# EAGLE design Power PCB (EAGLE 9.6.2)
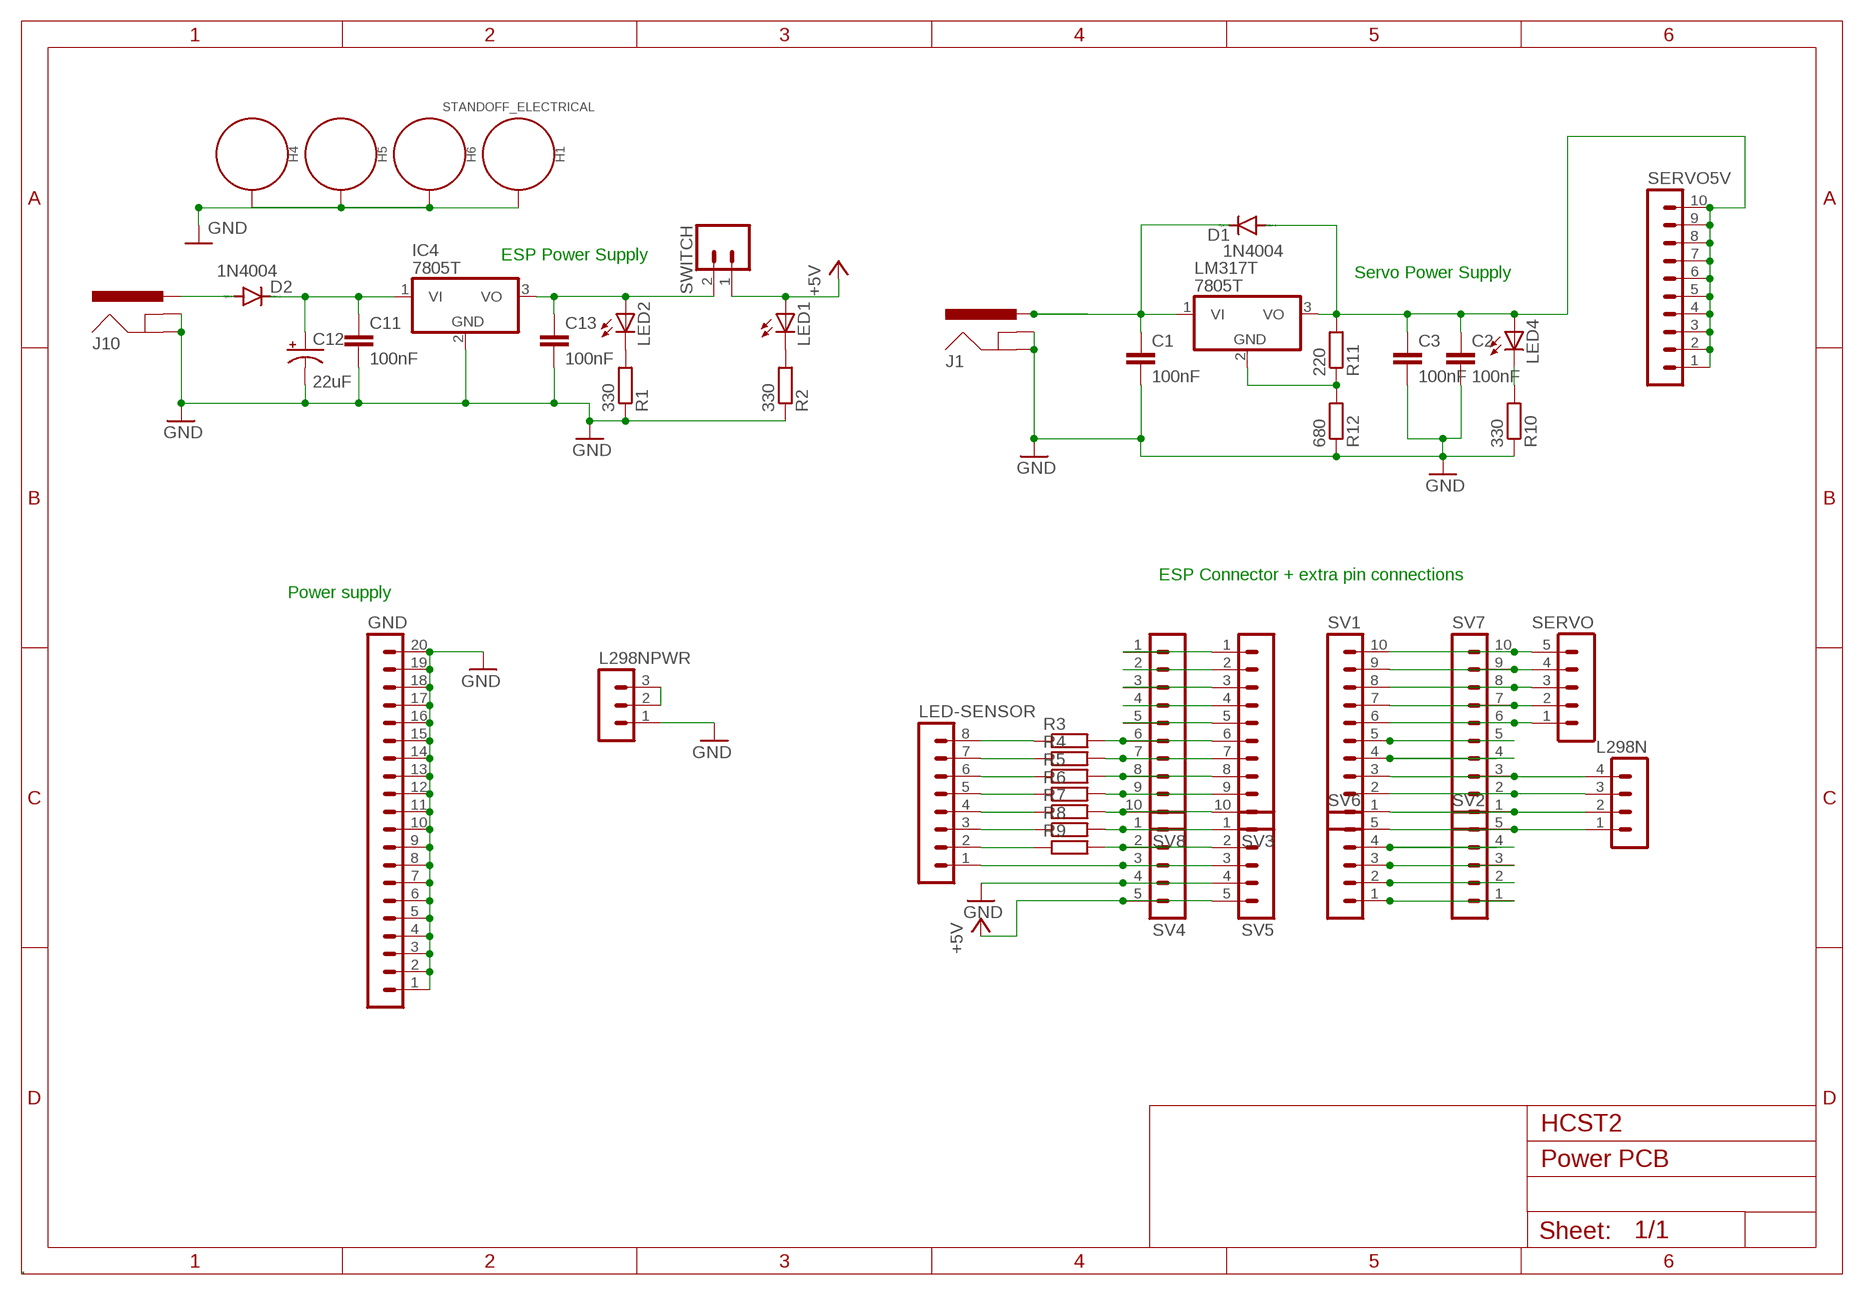
[diagram p0: schematic, sheet 1]

## Parts
C1  100nF  C2.5/2  [C2.5-2]
C2  100nF  C2.5/2  [C2.5-2]
C3  100nF  C2.5/2  [C2.5-2]
C11  100nF  C2.5/2  [C2.5-2]
C12  22uF  CPOL-USE2.5-7  [E2,5-7]
C13  100nF  C2.5/2  [C2.5-2]
D1  1N4004  [DO41-10]
D2  1N4004  [DO41-10]
GND  MA20-1  [MA20-1]
H1  STANDOFF_ELECTRICAL  [STANDOFF-ELECTRICAL]
H4  STANDOFF_ELECTRICAL  [STANDOFF-ELECTRICAL]
H5  STANDOFF_ELECTRICAL  [STANDOFF-ELECTRICAL]
H6  STANDOFF_ELECTRICAL  [STANDOFF-ELECTRICAL]
IC4  7805T  [TO220H]
J1  EL311-ROBOT_SPARKFUN-CONNECTORS_POWER_JACKPTH  [EL311-ROBOT_SPARKFUN-CONNECTORS_POWER_JACK_PTH]
J10  EL311-ROBOT_SPARKFUN-CONNECTORS_POWER_JACKPTH  [EL311-ROBOT_SPARKFUN-CONNECTORS_POWER_JACK_PTH]
L298N  MA04-1  [MA04-1]
L298NPWR  MA03-1  [MA03-1]
LED1  LED3MM  [LED3MM]
LED2  LED3MM  [LED3MM]
LED4  LED3MM  [LED3MM]
LED-SENSOR  MA08-1  [MA08-1]
LM317T  7805T  [TO220H]
R1  330  R-EU_0207/10  [0207/10]
R2  330  R-EU_0207/10  [0207/10]
R3  R-EU_0207/10  [0207/10]
R4  R-EU_0207/10  [0207/10]
R5  R-EU_0207/10  [0207/10]
R6  R-EU_0207/10  [0207/10]
R7  R-EU_0207/10  [0207/10]
R8  R-EU_0207/10  [0207/10]
R9  R-EU_0207/10  [0207/10]
R10  330  R-EU_0207/10  [0207/10]
R11  220  R-EU_0207/10  [0207/10]
R12  680  R-EU_0207/10  [0207/10]
SERVO  MA05-1  [MA05-1]
SERVO5V  MA10-1  [MA10-1]
SV1  MA10-1  [MA10-1]
SV2  MA05-1  [MA05-1]
SV3  MA10-1  [MA10-1]
SV4  MA05-1  [MA05-1]
SV5  MA05-1  [MA05-1]
SV6  MA05-1  [MA05-1]
SV7  MA10-1  [MA10-1]
SV8  MA10-1  [MA10-1]
SWITCH  CONN_02  [1X02]

## Nets
+5V [power]: LED1.A SV4.5 SV5.5 SWITCH.1
GND [power]: C1.2 C2.2 C3.2 C11.2 C12.- C13.2 GND.1 GND.2 GND.3 GND.4 GND.5 GND.6 GND.7 GND.8 GND.9 GND.10 GND.11 GND.12 GND.13 GND.14 GND.15 GND.16 GND.17 GND.18 GND.19 GND.20 H1.P1 H4.P1 H5.P1 H6.P1 IC4.2(GND) J1.GND J1.GNDBREAK J10.GND J10.GNDBREAK L298NPWR.1 R1.1 R2.1 R10.1 R12.1 SV4.4 SV5.4
N$1: L298N.1 SV2.5 SV6.5
N$2: SV1.5 SV7.5
N$3: SV1.4 SV7.4
N$4: SV2.4 SV6.4
N$5: SV2.3 SV6.3
N$6: LM317T.2(GND) R11.1 R12.2
N$7: L298N.2 SV1.1 SV7.1
N$8: L298N.3 SV1.2 SV7.2
N$9: L298N.4 SV1.3 SV7.3
N$10: SERVO.4 SV1.9 SV7.9
N$11: SERVO.3 SV1.8 SV7.8
N$12: SERVO.2 SV1.7 SV7.7
N$13: SERVO.1 SV1.6 SV7.6
N$14: SV2.2 SV6.2
N$15 [power]: C2.1 C3.1 D1.A LED4.A LM317T.3(VO) R11.2 SERVO5V.1 SERVO5V.2 SERVO5V.3 SERVO5V.4 SERVO5V.5 SERVO5V.6 SERVO5V.7 SERVO5V.8 SERVO5V.9 SERVO5V.10
N$16: LED-SENSOR.2 R9.1
N$17: LED4.K(C) R10.2
N$18: SV2.1 SV6.1
N$19: SV3.1 SV8.1
N$20: SV3.2 SV8.2
N$21: SV3.3 SV8.3
N$22: LED-SENSOR.1 SV4.3 SV5.3
N$23: R9.2 SV4.2 SV5.2
N$24: R8.2 SV4.1 SV5.1
N$25: R7.2 SV3.10 SV8.10
N$26: R6.2 SV3.9 SV8.9
N$27: R5.2 SV3.8 SV8.8
N$28: R4.2 SV3.7 SV8.7
N$29: SV3.4 SV8.4
N$30: SV3.5 SV8.5
N$34: R3.2 SV3.6 SV8.6
N$35 [power]: C13.1 IC4.3(VO) LED2.A SWITCH.2
N$36 [power]: L298NPWR.2 L298NPWR.3
N$38: LED2.K(C) R1.2
N$39: LED1.K(C) R2.2
N$41: LED-SENSOR.8 R3.1
N$42: LED-SENSOR.7 R4.1
N$43: LED-SENSOR.6 R5.1
N$44: LED-SENSOR.5 R6.1
N$45: LED-SENSOR.4 R7.1
N$46: LED-SENSOR.3 R8.1
N$47 [power]: SERVO.5 SV1.10 SV7.10
PWR1 [power]: C1.1 D1.C J1.PWR LM317T.1(VI)
PWR3 [power]: D2.A J10.PWR
PWR4 [power]: C11.1 C12.+ D2.C IC4.1(VI)

## Notes on the sheet
- ESP Power Supply
- Servo Power Supply
- ESP Connector + extra pin connections
- Power supply
- HCST2
- .

## Library data of the parts
C1-C3 C11 C13 = capacitor-wima:C: CAPACITOR naming: grid - package width
C12 = adafruit:CPOL-US: POLARIZED CAPACITOR, American symbol
D1 D2 = diode:1N4004: DIODE general purpose rectifier, 1 A
GND = con-lstb:MA20-1: PIN HEADER; OC_FARNELL: unknown; OC_NEWARK: unknown
H1 = EL311 2021:STANDOFF_ELECTRICAL: Stand Off Drill holes with an electrical connection. For example, use these to ground your board to a chassis. Example SparkFun Products Screw - Phillips Head (1/4", 4-40, 10 pack) <https://www.sparkfun.com/products/10453> (PRT-10453) Screw - Phillips Head (1/2", 4-40, 10 pack) <https://www.sparkfun.com/products/10452> (PRT-10452) Screw - Phillips Head (3/4", 4-40, 10 pack) <https://www.sparkfun.com/products/10451> (PRT-10451) Screw - Phillips Head (1", 4-40, 10 pack) <https://www.sparkfun.com/products/10450> (PRT-10450)
H4-H6 = SparkFun-Hardware:STANDOFF_ELECTRICAL: Stand Off Drill holes with an electrical connection. For example, use these to ground your board to a chassis. Example SparkFun Products Screw - Phillips Head (1/4", 4-40, 10 pack) <https://www.sparkfun.com/products/10453> (PRT-10453) Screw - Phillips Head (1/2", 4-40, 10 pack) <https://www.sparkfun.com/products/10452> (PRT-10452) Screw - Phillips Head (3/4", 4-40, 10 pack) <https://www.sparkfun.com/products/10451> (PRT-10451) Screw - Phillips Head (1", 4-40, 10 pack) <https://www.sparkfun.com/products/10450> (PRT-10450)
IC4 LM317T = adafruit:78*: Positive VOLTAGE REGULATOR Added bigger pads to the TO-92 package
J1 J10 = EL311_2017_18:EL311-ROBOT_SPARKFUN-CONNECTORS_POWER_JACK: Power Jack This is the standard 5.5mm barrel jack for power. The PTH is the most common, proven, reliable, footprint. The Slot footprint only works if the mill layer is transmitted to the PCB fab house so be warned. Mating wall wart : TOL-00298 (and others); PROD_ID: PRT-00119
L298N = con-lstb:MA04-1: PIN HEADER; OC_FARNELL: unknown; OC_NEWARK: unknown
L298NPWR = con-lstb:MA03-1: PIN HEADER; OC_FARNELL: unknown; OC_NEWARK: unknown
LED1 LED2 LED4 = EL311 2021:LED: LED OSRAM: - CHIPLED LG R971, LG N971, LY N971, LG Q971, LY Q971, LO R971, LY R971 LH N974, LH R974 LS Q976, LO Q976, LY Q976 LO Q996 - Hyper CHIPLED LW Q18S LB Q993, LB Q99A, LB R99A - SideLED LS A670, LO A670, LY A670, LG A670, LP A670 LB A673, LV A673, LT A673, LW A673 LH A674 LY A675 LS A676, LA A676, LO A676, LY A676, LW A676 LS A679, LY A679, LG A679 - Hyper Micro SIDELED® LS Y876, LA Y876, LO Y876, LY Y876 LT Y87S - SmartLED LW L88C, LW L88S LB L89C, LB L89S, LG L890 LS L89K, LO L89K, LY L89K LS L896, LA L896, LO L896, LY L896 - TOPLED LS T670, LO T670, LY T670, LG T670, LP T670 LSG T670, LSP T670, LSY T670, LOP T670, LYG T670 LG T671, LOG T671, LSG T671 LB T673, LV T673, LT T673, LW T673 LH T674 LS T676, LA T676, LO T676, LY T676, LB T676, LH T676, LSB T676, LW T676 LB T67C, LV T67C, LT T67C, LS T67K, LO T67K, LY T67K, LW E67C LS E67B, LA E67B, LO E67B, LY E67B, LB E67C, LV E67C, LT E67C LW T67C LS T679, LY T679, LG T679 LS T770, LO T770, LY T770, LG T770, LP T770 LB T773, LV T773, LT T773, LW T773 LH T774 LS E675, LA E675, LY E675, LS T675 LS T776, LA T776, LO T776, LY T776, LB T776 LHGB T686 LT T68C, LB T68C - Hyper Mini TOPLED® LB M676 - Mini TOPLED Santana® LG M470 LS M47K, LO M47K, LY M47K Source: http://www.osram.convergy.de/
LED-SENSOR = con-lstb:MA08-1: PIN HEADER; OC_FARNELL: unknown; OC_NEWARK: unknown
R1-R12 = EL311 2021:R-EU_: RESISTOR, European symbol
SERVO SV2 SV4-SV6 = con-lstb:MA05-1: PIN HEADER; OC_FARNELL: unknown; OC_NEWARK: unknown
SERVO5V SV1 SV3 SV7 SV8 = con-lstb:MA10-1: PIN HEADER; OC_FARNELL: unknown; OC_NEWARK: unknown
SWITCH = EL311 2021:CONN_02: Multi connection point. Often used as Generic Header-pin footprint for 0.1 inch spaced/style header connections On any of the 0.1 inch spaced packages, you can populate with these: Break Away Headers - Straight <https://www.sparkfun.com/products/116> (PRT-00116) Break Away Male Headers - Right Angle <https://www.sparkfun.com/products/553> (PRT-00553) Female Headers <https://www.sparkfun.com/products/115> (PRT-00115) Break Away Headers - Machine Pin <https://www.sparkfun.com/products/117> (PRT-00117) Break Away Female Headers - Swiss Machine Pin <https://www.sparkfun.com/products/743> (PRT-00743) For SCREWTERMINALS and SPRING TERMINALS visit here: Screw Terimnals on SparkFun.com <https://www.sparkfun.com/search/results?term=Screw+Terminals> (5mm/3.5mm/2.54mm spacing) This device is also useful as a general connection point to wire up your design to another part of your project. Our various solder wires solder well into these plated through hole pads. Hook-Up Wire - Assortment (Stranded, 22 AWG) <https://www.sparkfun.com/products/11375> (PRT-11375) Hook-Up Wire - Assortment (Solid Core, 22 AWG) <https://www.sparkfun.com/products/11367> (PRT-11367) View the entire wire category on our website here <https://www.sparkfun.com/categories/141> Special notes: Molex polarized connector foot print use with: PRT-08233 with associated crimp pins and housings. 2.54_SCREWTERM for use with PRT-10571. 3.5mm Screw Terminal footprints for PRT-08084 5mm Screw Terminal footprints for use with PRT-08432; PROD_ID: CONN-13512; SF_ID: PRT-09918; SF_SKU: PRT-08432; SKU: PRT-09914

## Net classes
0 default: width 0.406 mm, drill 0.406 mm, clearance 0.406 mm
1 power: width 0.635 mm, drill 0.406 mm, clearance 0.406 mm
2 Power2: width 1.397 mm, drill 0.406 mm, clearance 0.406 mm

## Board
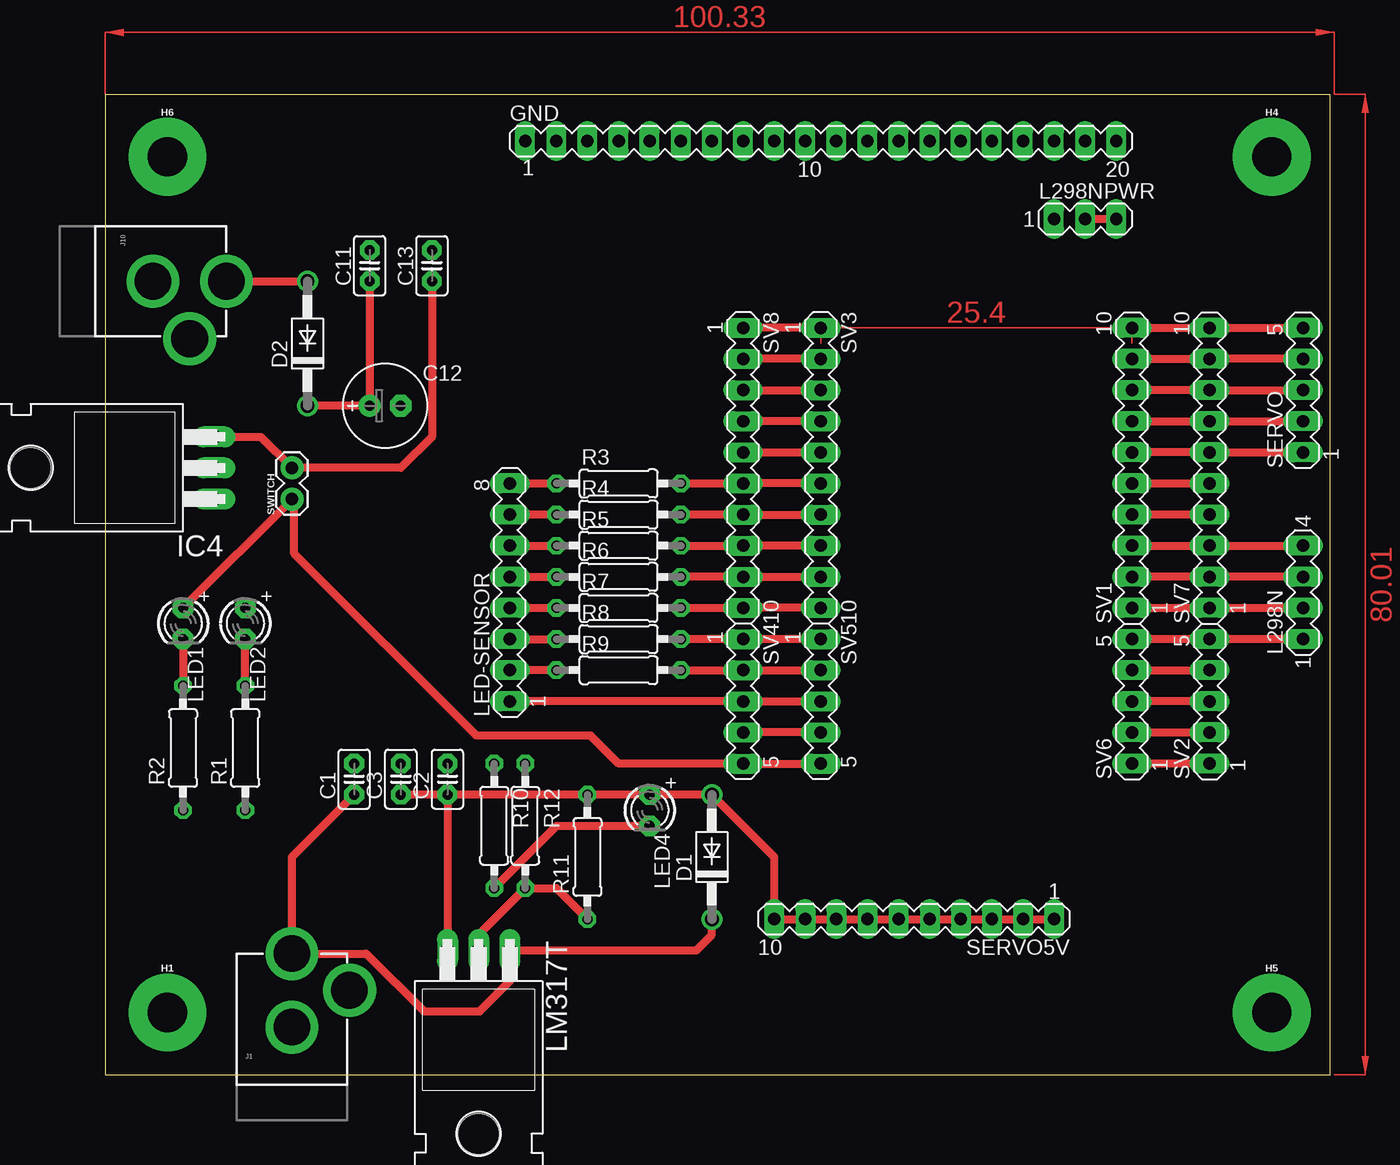
[diagram p1: board, top side]
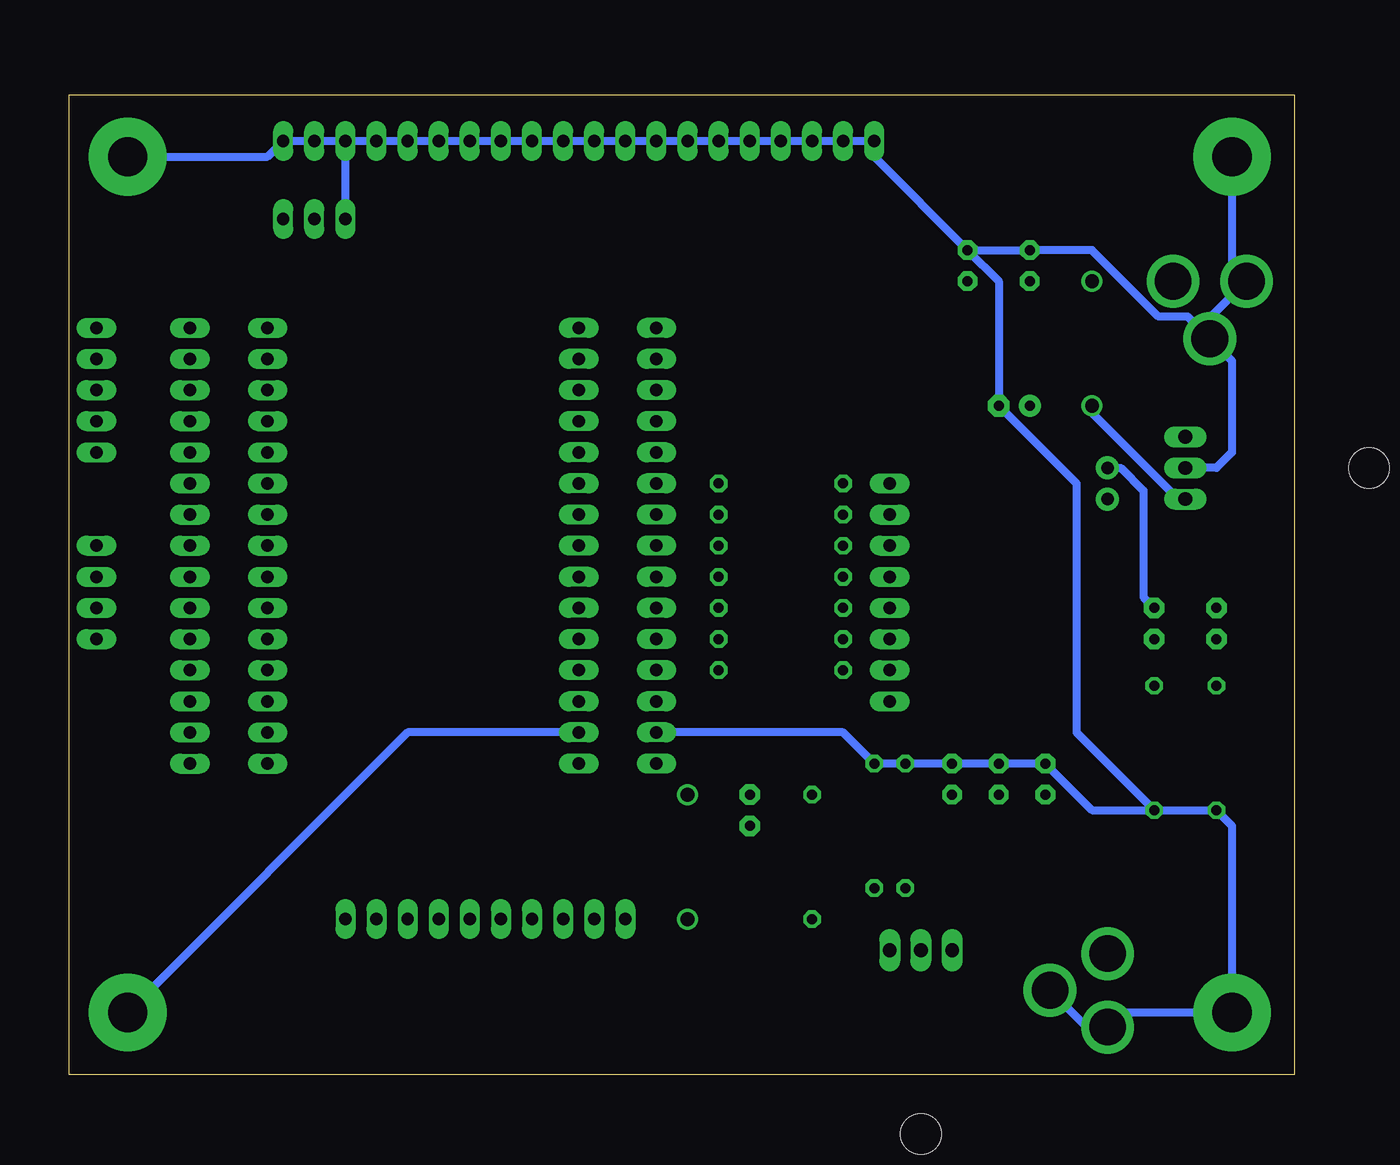
[diagram p2: board, bottom side, seen from below]

Size 100 x 80 mm. Coordinates in mm from the lower left corner, seen from the top.
Outline: 0,0 100,0 100,80 0,80 0,0
Copper layers (1*16): Top 0.035mm / dielectric 1.5mm / Bottom 0.035mm
Design rules "EL311_DRC_2020": minimum track width 12mil, minimum drill 18mil, track to track 12mil, track to pad 12mil, pad to pad 12mil, via to via 12mil, smd to smd 12mil, copper to edge 12mil, drill to drill 15mil, minimum pad ring 12mil, minimum via ring 10mil, stop-mask expansion 4mil, vias tented up to drill 25mil, thermal gap 10mil

### Footprints (pad centres in the part's own frame; a part is rotated, then mirrored left to right if it is on the bottom)
C2.5-2 = drill 0.813 pad 1.6 octagon: 1 -1.27,0; 2 1.27,0
E2,5-7 = drill 0.813 pad 1.778: + -1.27,0 | drill 0.813 pad 1.778 octagon: - 1.27,0
DO41-10 = drill 1.118: A 5.08,0; C -5.08,0
MA20-1 = drill 1.016 long: 1 -24.13,0; 2 -21.59,0; 3 -19.05,0; 4 -16.51,0; 5 -13.97,0; 6 -11.43,0; 7 -8.89,0; 8 -6.35,0; 9 -3.81,0; 10 -1.27,0; 11 1.27,0; 12 3.81,0; 13 6.35,0; 14 8.89,0; 15 11.43,0; 16 13.97,0; 17 16.51,0; 18 19.05,0; 19 21.59,0; 20 24.13,0
STANDOFF-ELECTRICAL = drill 3.2 pad 6.35: P1 0,0
TO220H = drill 1.118 long: 1 -2.54,-10.16; 2 0,-10.16; 3 2.54,-10.16 | hole 3.302: 0,4.826
EL311-ROBOT_SPARKFUN-CONNECTORS_POWER_JACK_PTH = drill 2.997 pad 4.318: GND 0,7.7; GNDBREAK 4.7,10.7; PWR 0,13.7
MA04-1 = drill 1.016 long: 1 -3.81,0; 2 -1.27,0; 3 1.27,0; 4 3.81,0
MA03-1 = drill 1.016 long: 1 -2.54,0; 2 0,0; 3 2.54,0
LED3MM = drill 0.813 pad 1.676 octagon: A -1.27,0; K 1.27,0
MA08-1 = drill 1.016 long: 1 -8.89,0; 2 -6.35,0; 3 -3.81,0; 4 -1.27,0; 5 1.27,0; 6 3.81,0; 7 6.35,0; 8 8.89,0
0207/10 = drill 0.813 octagon: 1 -5.08,0; 2 5.08,0
MA05-1 = drill 1.016 long: 1 -5.08,0; 2 -2.54,0; 3 0,0; 4 2.54,0; 5 5.08,0
MA10-1 = drill 1.016 long: 1 -11.43,0; 2 -8.89,0; 3 -6.35,0; 4 -3.81,0; 5 -1.27,0; 6 1.27,0; 7 3.81,0; 8 6.35,0; 9 8.89,0; 10 11.43,0
1X02 = drill 1.016 pad 1.88: 1 0,0; 2 2.54,0

### Placement (x,y rotation side)
C1  20.32,24.13 90 top
C2  27.94,24.13 90 top
C3  24.13,24.13 90 top
C11  21.59,66.04 90 top
C12  22.86,54.61 0 top
C13  26.67,66.04 90 top
D1  49.53,17.78 90 top
D2  16.51,59.69 90 top
GND  58.42,76.2 0 top
H1  5.08,5.08 0 top
H4  95.25,74.93 0 top
H5  95.25,5.08 0 top
H6  5.08,74.93 0 top
IC4  -1.27,49.53 90 top
J1  15.24,-3.81 0 top
J10  -3.81,64.77 270 top
L298N  97.79,39.37 90 top
L298NPWR  80.01,69.85 0 top
LED1  6.35,36.83 270 top
LED2  11.43,36.83 270 top
LED4  44.45,21.59 270 top
LED-SENSOR  33.02,39.37 90 top
LM317T  30.48,0 180 top
R1  11.43,26.67 90 top
R2  6.35,26.67 90 top
R3  41.91,48.26 0 top
R4  41.91,45.72 0 top
R5  41.91,43.18 0 top
R6  41.91,40.64 0 top
R7  41.91,38.1 0 top
R8  41.91,35.56 0 top
R9  41.91,33.02 0 top
R10  31.75,20.32 270 top
R11  39.37,17.78 90 top
R12  34.29,20.32 270 top
SERVO  97.79,55.88 90 top
SERVO5V  66.04,12.7 180 top
SV1  83.82,49.53 90 top
SV2  90.17,30.48 90 top
SV3  58.42,49.53 270 top
SV4  52.07,30.48 270 top
SV5  58.42,30.48 270 top
SV6  83.82,30.48 90 top
SV7  90.17,49.53 90 top
SV8  52.07,49.53 270 top
SWITCH  15.24,46.99 90 top

### Tracks (layer width: path | path; a pad name or v marks a point on that pad's centre or on a via)
+5V
  Top 0.635: LED1.A SWITCH.1 15.43,46.8 15.43,42.54 30.3,27.67 39.64,27.67 41.91,25.4 SV4.5 SV5.5
GND
  Top 0.635: SV5.4 SV4.4
  Bottom 0.635: C13.2 C11.2 16.51,67.31 11.08,61.89 8.71,61.89 J10.GNDBREAK | C13.2 34.29,74.93 GND.1 GND.2 GND.3 GND.4 GND.5 GND.6 GND.7 GND.8 GND.9 GND.10 GND.11 GND.12 GND.13 GND.14 GND.15 GND.16 GND.17 GND.18 | R1.1 R2.1 5.08,20.32 H1.P1 14.05,5.08 J1.GND 16.94,3.89 J1.GNDBREAK | R1.1 17.78,27.94 17.78,48.26 C12.- 24.13,64.77 C13.2 | H6.P1 5.08,65.96 J10.GND 6.89,61.77 J10.GNDBREAK | H4.P1 83.82,74.93 GND.20 GND.19 GND.18 | L298NPWR.1 GND.18 | R1.1 16.51,21.59 C1.2 C3.2 C2.2 R10.1 R12.1 36.83,27.94 SV4.4 | SV5.4 72.39,27.94 H5.P1 | IC4.2 6.35,49.53 5.08,50.8 5.08,58.26 J10.GNDBREAK
N$1
  Top 0.635: SV6.5 SV2.5 L298N.1
N$2
  Top 0.635: SV1.5 SV7.5
N$3
  Top 0.635: SV7.4 SV1.4
N$4
  Top 0.635: SV6.4 SV2.4
N$5
  Top 0.635: SV2.3 SV6.3
N$6
  Top 0.635: R11.1 36.83,15.24 R12.2 30.48,11.43 LM317T.2
N$7
  Top 0.635: SV1.1 SV7.1 L298N.2
N$8
  Top 0.635: SV1.2 SV7.2 L298N.3
N$9
  Top 0.635: SV1.3 SV7.3 L298N.4
N$10
  Top 0.635: SV1.9 SV7.9 SERVO.4
N$11
  Top 0.635: SV1.8 SV7.8 SERVO.3
N$12
  Top 0.635: SV1.7 SV7.7 SERVO.2
N$13
  Top 0.635: SV1.6 SV7.6 SERVO.1
N$14
  Top 0.635: SV6.2 SV2.2
N$15
  Top 0.635: C2.1 R11.2 LED4.A D1.A 54.61,17.78 SERVO5V.10 SERVO5V.9 SERVO5V.8 SERVO5V.7 SERVO5V.6 SERVO5V.5 SERVO5V.4 SERVO5V.3 SERVO5V.2 SERVO5V.1 | C2.1 C3.1 | C2.1 LM317T.3
N$16
  Top 0.635: R9.1 LED-SENSOR.2
N$17
  Top 0.635: R10.2 36.83,20.32 LED4.K
N$18
  Top 0.635: SV2.1 SV6.1
N$19
  Top 0.635: SV3.1 SV8.1
N$20
  Top 0.635: SV3.2 SV8.2
N$21
  Top 0.635: SV8.3 SV3.3
N$22
  Top 0.635: SV5.3 SV4.3 LED-SENSOR.1
N$23
  Top 0.635: SV5.2 SV4.2 R9.2
N$24
  Top 0.635: SV5.1 SV4.1 R8.2
N$25
  Top 0.635: SV3.10 SV8.10 R7.2
N$26
  Top 0.635: SV3.9 SV8.9 R6.2
N$27
  Top 0.635: SV3.8 SV8.8 R5.2
N$28
  Top 0.635: SV3.7 SV8.7 R4.2
N$29
  Top 0.635: SV3.4 SV8.4
N$30
  Top 0.635: SV8.5 SV3.5
N$34
  Top 0.635: SV3.6 SV8.6 R3.2
N$35
  Top 0.635: C13.1 26.67,52.07 24.13,49.53 SWITCH.2 12.7,52.07 IC4.3
  Bottom 0.635: SWITCH.2 14.16,49.53 12.31,47.68 12.31,38.98 LED2.A
N$36
  Top 0.635: L298NPWR.2 L298NPWR.3
N$38
  Top 0.635: R1.2 LED2.K
N$39
  Top 0.635: LED1.K R2.2
N$41
  Top 0.635: LED-SENSOR.8 35.56,48.26 | 35.56,48.26 R3.1 | 35.56,48.26
N$42
  Top 0.635: R4.1 LED-SENSOR.7
N$43
  Top 0.635: LED-SENSOR.6 R5.1
N$44
  Top 0.635: LED-SENSOR.5 R6.1
N$45
  Top 0.635: LED-SENSOR.4 R7.1
N$46
  Top 0.635: LED-SENSOR.3 R8.1
N$47
  Top 0.635: SV1.10 SV7.10 SERVO.5
PWR1
  Top 0.635: C1.1 15.24,17.78 J1.PWR 21.29,9.89 26.01,5.17 30.57,5.17 33.02,7.62 LM317T.1 48.26,10.16 49.53,11.43 D1.C
PWR3
  Top 0.635: J10.PWR D2.A
PWR4
  Top 0.635: C11.1 C12.+ D2.C
  Bottom 0.635: IC4.1 9.46,46.99 16.51,54.04 D2.C
(copper drawn outside any net)
  shapes: Top area x3